# EasyEDA Pro project 作业4.eprj

# Schematic Schematic1
Board Name: Board1; Create Date: 2025-07-05; Page Name: P1; Project Name: 作业4; Schematic Name: Schematic1; Update Date: 2025-07-05; Company: 嘉立创EDA; Page Size: A4; Version: V1.0
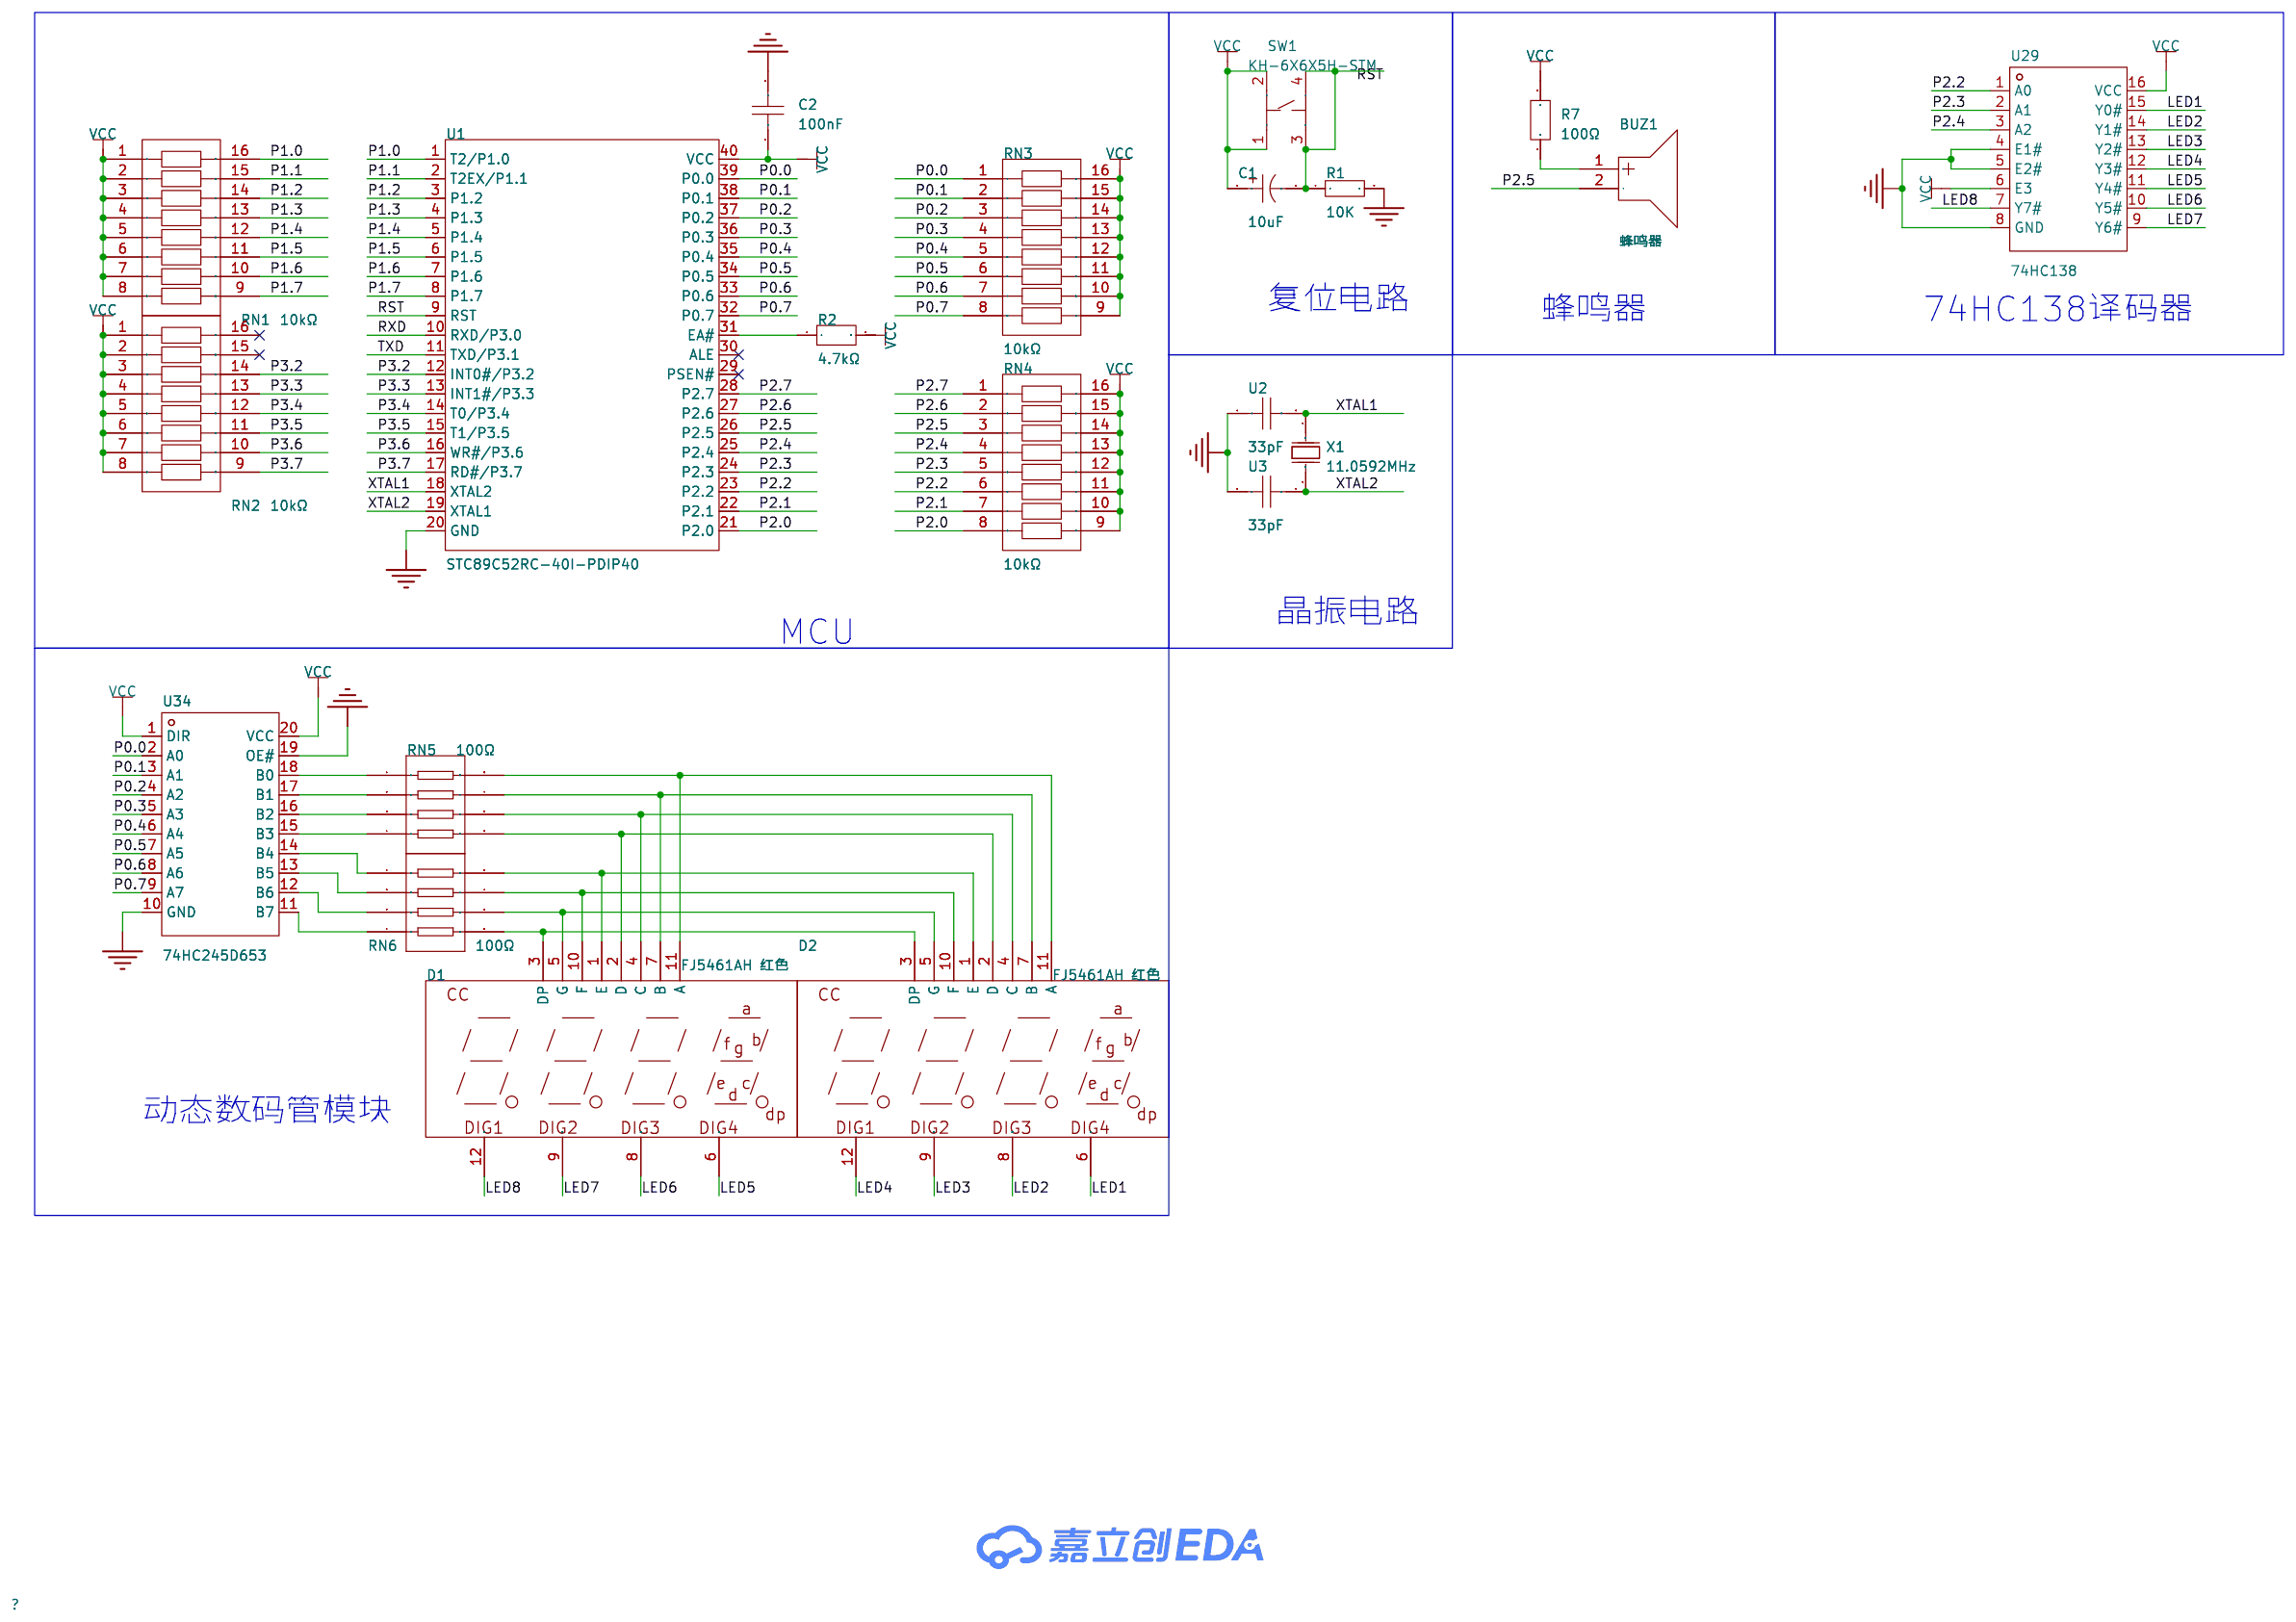
[diagram p0: schematic sheet]

## Parts
BUZ1  蜂鸣器  [BUZ-TH_BD9.0-P5.00-D0.6-FD]
C1  10uF  [CAP-TH_BD10.0-P5.00-D0.6-FD_1]
C2  100nF  [C0603]
D1  FJ5461AH 红色  [LED-SEG-TH_FJ5461AH]
D2  FJ5461AH 红色  [LED-SEG-TH_FJ5461AH]
R1  10K  [R0603]
R2  4.7kΩ  [R0805]
R7  100Ω  [R1206]
RN1  10kΩ  [DIP-16_L22.0-W6.7-P2.54-LS7.6-BL]
RN2  10kΩ  [DIP-16_L22.0-W6.7-P2.54-LS7.6-BL]
RN3  10kΩ  [DIP-16_L22.0-W6.7-P2.54-LS7.6-BL]
RN4  10kΩ  [DIP-16_L22.0-W6.7-P2.54-LS7.6-BL]
RN5  100Ω  [RES-ARRAY-SMD_0402-8P-L2.0-W1.0-BL]
RN6  100Ω  [RES-ARRAY-SMD_0402-8P-L2.0-W1.0-BL]
SW1  KH-6X6X5H-STM  [SW-SMD_4P-L6.0-W6.0-P4.50-LS9.0_H5.0]
U1  STC89C52RC-40I-PDIP40  [DIP-40_L52.0-W13.7-P2.54-LS15.2-BL]
U2  33pF  [C0603]
U3  33pF  [C0603]
U29  74HC138  [SOIC-16_L9.9-W3.9-P1.27-LS6.0-BL]
U34  74HC245D653  [SOIC-20_L13.0-W7.6-P1.27-LS10.3-BL]
X1  11.0592MHz  [HC-49US_L11.5-W4.5-P4.88]

## Library data of the parts
BUZ1 = 蜂鸣器: Supplier Part: C9900020875; Supplier Footprint: 插件; JLCPCB Part Class: 扩展库; Supplier: LCSC
C1 = CV100MPA16B: 容值:10uF;精度:±20%;额定电压:450V;纹波电流:200mA@100kHz;等效串联电阻(ESR):9Ω@100kHz;; LCSC Part Name: 10uF ±20% 450V; Supplier Part: C911241; Manufacturer: TWBOR(伯鸿); Supplier Footprint: 插件,D10xL16mm; JLCPCB Part Class: 扩展库; Datasheet: https://atta.szlcsc.com/upload/public/pdf/source/20201117/C911241_08C53D140102C9DE5D4425A5E1B3FE4F.pdf; Supplier: LCSC; Tolerance: ±20%; Voltage Rating: 450V; Ripple Current: 200mA@100kHz; Equivalent Series Resistance(ESR): 9Ω@100kHz; Pin Spacing: 5mm; Diameter: 10mm; Height - Seated (Max): 16mm; Lifetime: 5000hrs@105℃; Operating Temperature: -25℃~+105℃
C2 = 0603X7R104K250NT: 容值:100nF;精度:±10%;额定电压:25V;温度系数:X7R;; LCSC Part Name: 100nF ±10% 25V; Supplier Part: C48579280; Manufacturer: AIDE(爱迪电容); Supplier Footprint: 0603; JLCPCB Part Class: 扩展库; Datasheet: https://atta.szlcsc.com/upload/public/pdf/source/20210330/C2691711_5D01E1D4D7BF54205139C8425089DFE9.pdf; Supplier: LCSC; Tolerance: ±10%; Voltage Rating: 25V; Temperature Coefficient: X7R
D1 D2 = FJ5461AH 红色: 数码管位数:4位;功耗:-;发光颜色:红色;LED极性:共阴极;数字/字母大小(英寸):0.56;; LCSC Part Name: 4位0.56英寸红色数码管 共阴极; Supplier Part: C54396; Manufacturer: 志浩; Supplier Footprint: 插件; JLCPCB Part Class: 扩展库; Datasheet: https://atta.szlcsc.com/upload/public/pdf/source/20151111/1457707576636.pdf; Supplier: LCSC; Number of Characters: 4位; Display Type: 7段; Luminous Color: 红色; LED Polarity: 共阴极; Digit/Alpha Size(inch): 0.56
R1 = Res_0603: Supplier Footprint: 0603
R2 = ERJ-U06F4701V: 电阻类型:厚膜电阻;阻值:4.7kΩ;精度:±1%;功率:125mW;工作电压:-;温度系数:±100ppm/℃;; LCSC Part Name: 4.7kΩ ±1% 125mW 厚膜电阻; Supplier Part: C1859462; Manufacturer: PANASONIC(松下); Supplier Footprint: 0805; JLCPCB Part Class: 扩展库; Datasheet: https://atta.szlcsc.com/upload/public/pdf/source/20210624/C1859462_0DC8A541405FCF91B34CFE3F505433C6.pdf; Supplier: LCSC; Type: 厚膜电阻; Tolerance: ±1%; Power(Watts): 125mW; Temperature Coefficient: ±100ppm/℃; Operating Temperature: -55℃~+155℃
R7 = CQ06W4J0101T5E: 电阻类型:-;阻值:100Ω;精度:±5%;功率:250mW;工作电压:200V;; LCSC Part Name: 100Ω ±5% 250mW; Supplier Part: C2765667; Manufacturer: UNI-ROYAL(厚声); Supplier Footprint: 1206; JLCPCB Part Class: 扩展库; Datasheet: https://atta.szlcsc.com/upload/public/pdf/source/20210330/C2758625_90D19EEA9B8C23AA9BAF71D52BD1DB3E.pdf; Supplier: LCSC; Tolerance: ±5%; Power(Watts): 250mW; Voltage-Supply(Max): 200V; Operating Temperature: -55℃~+155℃
RN1-RN4 = 4116R-1-103LF: 电阻器数:8;阻值:10kΩ;精度:±2%;单个元件功率:250mW;温度系数:±100ppm/℃;; LCSC Part Name: 10kΩ ±2%; Supplier Part: C6087381; Manufacturer: BOURNS; Supplier Footprint: DIP-16; Datasheet: https://atta.szlcsc.com/upload/public/pdf/source/20210630/3D9C012B231BA1D1C9C6139B97130D1A.pdf; Supplier: LCSC; Number of Resistors: 8; Tolerance: ±2%; Power(Watts): 250mW; Temperature Coefficient: ±100ppm/℃; Number of Pins: 16
RN5 RN6 = 4D02WGJ0101TCE: 电阻器数:4;阻值:100Ω;精度:±5%;单个元件功率:62.5mW;温度系数:±200ppm/℃;; LCSC Part Name: 100Ω ±5%; Supplier Part: C48442; Manufacturer: UNI-ROYAL(厚声); Supplier Footprint: 0402x4; JLCPCB Part Class: 扩展库; Datasheet: https://atta.szlcsc.com/upload/public/pdf/source/20191224/C474318_2527498AE30E813171187CCD28401A71.pdf; Supplier: LCSC; Number of Resistors: 4; Tolerance: ±5%; Power(Watts): 62.5mW; Temperature Coefficient: ±200ppm/℃; Number of Pins: 8
SW1 = KH-6X6X5H-STM: 电路结构:单刀单掷;按钮形状:圆形按钮;安装方式:立贴;开关长度:6mm;开关宽度:6mm;开关高度:5mm;带支架:不带;触点电流:50mA;额定电压(DC):12V;机械寿命:8万次;; LCSC Part Name: 6*6*5mm 立贴 轻触开关; Supplier Part: C2837531; Manufacturer: kinghelm(金航标); Supplier Footprint: SMD; JLCPCB Part Class: 扩展库; Datasheet: https://atta.szlcsc.com/upload/public/pdf/source/20210608/C2837531_45E87AB996CE723B09405FF2EA209C4C.pdf; Supplier: LCSC; Circuit: 单刀单掷; Actuator Style: 圆形按钮; Mounting Style: 立贴; Switch Length: 6mm; Switch Width: 6mm; Switch Height: 5mm; Strike Gundam: 不带; Contact Current: 50mA; Voltage Rating (DC): 12V; Actuator/Cap Color: 黑色; Pin Style: 鸥翼型; Mechanical Life: 8万次
U1 = STC89C52RC-40I-PDIP40: CPU内核:51系列;应用领域:-;; Supplier Part: C14022; Manufacturer: STC; Supplier Footprint: DIP-40; JLCPCB Part Class: 扩展库; Datasheet: https://atta.szlcsc.com/upload/public/pdf/source/20250219/C2F0DDDE7C5E9ADA5B33742D18630F09.pdf; Supplier: LCSC; CPU Core: 51系列; Program Storage Size: 8KB; Program Memory Type: FLASH; Number of I/O: 35; Voltage - Supply: 3.3V~5.5V
U2 U3 = GRM1885C1H330FA01D: 容值:33pF;精度:±1%;额定电压:50V;温度系数:-;; LCSC Part Name: 33pF ±1% 50V; Supplier Part: C882522; Manufacturer: muRata(村田); Supplier Footprint: 0603; JLCPCB Part Class: 扩展库; Datasheet: https://atta.szlcsc.com/upload/public/pdf/source/20200305/C490387_23319AE8C154DEB24C505E6C82A8106A.pdf; Supplier: LCSC; Tolerance: ±1%; Voltage Rating: 50V
U29 = 74HC138: 三八译码器，74系列逻辑芯片,2.0V-6.0V供电电压。; LCSC Part Name: 停产; Supplier Part: C86611; Manufacturer: FM(富满); Supplier Footprint: SOIC-16; JLCPCB Part Class: 扩展库; Datasheet: https://atta.szlcsc.com/upload/public/pdf/source/20170103/1483435332227.pdf; Supplier: LCSC
U34 = 74HC245D653: Supplier Part: C70245; Supplier Footprint: SOIC-20-300mil; JLCPCB Part Class: 扩展库; Supplier: LCSC
X1 = X49SD110592MSD2SC: 晶振类型:直插晶振;频率:11.0592MHz;常温频差:±20ppm;负载电容:20pF;频率稳定度:±30ppm;; LCSC Part Name: HC-49US 11.0592MHZ 2P 49S 20PF ±20PPM -20~70℃（±30PPM）; Supplier Part: C2203; Manufacturer: YXC(扬兴晶振); Supplier Footprint: HC-49S; JLCPCB Part Class: 扩展库; Datasheet: https://atta.szlcsc.com/upload/public/pdf/source/20240329/977D7F2434F98B2BE33270BB9FF3D86D.pdf; Supplier: LCSC; Type: 直插晶振; Normal temperature Frequency Tolerance: ±20ppm; Load Capacitance: 20pF; Frequency Stability: ±30ppm; Operating Temperature: -20℃~+70℃

## Nets
GND: C2.2 R1.2 U1.20(GND) U2.1 U3.2 U29.4(E1#) U29.5(E2#) U29.8(GND) U34.10(GND) U34.19(OE#)
VCC: C1.1 C2.1 R2.2 R7.2 RN1.1 RN1.2 RN1.3 RN1.4 RN1.5 RN1.6 RN1.7 RN1.8 RN2.1 RN2.2 RN2.3 RN2.4 RN2.5 RN2.6 RN2.7 RN2.8 RN3.9 RN3.10 RN3.11 RN3.12 RN3.13 RN3.14 RN3.15 RN3.16 RN4.9 RN4.10 RN4.11 RN4.12 RN4.13 RN4.14 RN4.15 RN4.16 SW1.1 SW1.2 U1.40(VCC) U29.6(E3) U29.16(VCC) U34.1(DIR) U34.20(VCC)
LED1: D2.6(DIG4) U29.15(Y0#)
LED2: D2.8(DIG3) U29.14(Y1#)
LED3: D2.9(DIG2) U29.13(Y2#)
LED4: D2.12(DIG1) U29.12(Y3#)
LED5: D1.6(DIG4) U29.11(Y4#)
LED6: D1.8(DIG3) U29.10(Y5#)
LED7: D1.9(DIG2) U29.9(Y6#)
LED8: D1.12(DIG1) U29.7(Y7#)
P0.0: RN3.1 U1.39(P0.0) U34.2(A0)
P0.1: RN3.2 U1.38(P0.1) U34.3(A1)
P0.2: RN3.3 U1.37(P0.2) U34.4(A2)
P0.3: RN3.4 U1.36(P0.3) U34.5(A3)
P0.4: RN3.5 U1.35(P0.4) U34.6(A4)
P0.5: RN3.6 U1.34(P0.5) U34.7(A5)
P0.6: RN3.7 U1.33(P0.6) U34.8(A6)
P0.7: RN3.8 U1.32(P0.7) U34.9(A7)
P1.0: RN1.16 U1.1(T2/P1.0)
P1.1: RN1.15 U1.2(T2EX/P1.1)
P1.2: RN1.14 U1.3(P1.2)
P1.3: RN1.13 U1.4(P1.3)
P1.4: RN1.12 U1.5(P1.4)
P1.5: RN1.11 U1.6(P1.5)
P1.6: RN1.10 U1.7(P1.6)
P1.7: RN1.9 U1.8(P1.7)
P2.0: RN4.8 U1.21(P2.0)
P2.1: RN4.7 U1.22(P2.1)
P2.2: RN4.6 U1.23(P2.2) U29.1(A0)
P2.3: RN4.5 U1.24(P2.3) U29.2(A1)
P2.4: RN4.4 U1.25(P2.4) U29.3(A2)
P2.5: BUZ1.2(-) RN4.3 U1.26(P2.5)
P2.6: RN4.2 U1.27(P2.6)
P2.7: RN4.1 U1.28(P2.7)
P3.2: RN2.14 U1.12(INT0#/P3.2)
P3.3: RN2.13 U1.13(INT1#/P3.3)
P3.4: RN2.12 U1.14(T0/P3.4)
P3.5: RN2.11 U1.15(T1/P3.5)
P3.6: RN2.10 U1.16(WR#/P3.6)
P3.7: RN2.9 U1.17(RD#/P3.7)
RST: C1.2 R1.1 SW1.3 SW1.4 U1.9(RST)
RXD: U1.10(RXD/P3.0)
TXD: U1.11(TXD/P3.1)
XTAL1: U1.18(XTAL2) U2.2 X1.1(OSC1)
XTAL2: U1.19(XTAL1) U3.1 X1.2(OSC2)
$1N691: R2.1 U1.31(EA#)
$1N1178: BUZ1.1(+) R7.1
$1N1716: RN5.1 U34.18(B0)
$1N1717: RN5.2 U34.17(B1)
$1N1718: RN5.3 U34.16(B2)
$1N1719: RN5.4 U34.15(B3)
$1N1720: RN6.1 U34.14(B4)
$1N1721: RN6.2 U34.13(B5)
$1N1722: RN6.3 U34.12(B6)
$1N1723: RN6.4 U34.11(B7)
$1N1724: D1.11(A) D2.11(A) RN5.8
$1N1725: D1.7(B) D2.7(B) RN5.7
$1N1726: D1.4(C) D2.4(C) RN5.6
$1N1727: D1.2(D) D2.2(D) RN5.5
$1N1728: D1.1(E) D2.1(E) RN6.8
$1N1729: D1.10(F) D2.10(F) RN6.7
$1N1730: D1.5(G) D2.5(G) RN6.6
$1N1731: D1.3(DP) D2.3(DP) RN6.5

Not connected (* = marked no-connect by the designer): RN2 15* 16*; U1 29(PSEN#)* 30(ALE)*

## Notes on the sheet
- 复位电路
- 蜂鸣器
- 74HC138译码器
- 晶振电路
- MCU
- 动态数码管模块

# Board PCB1
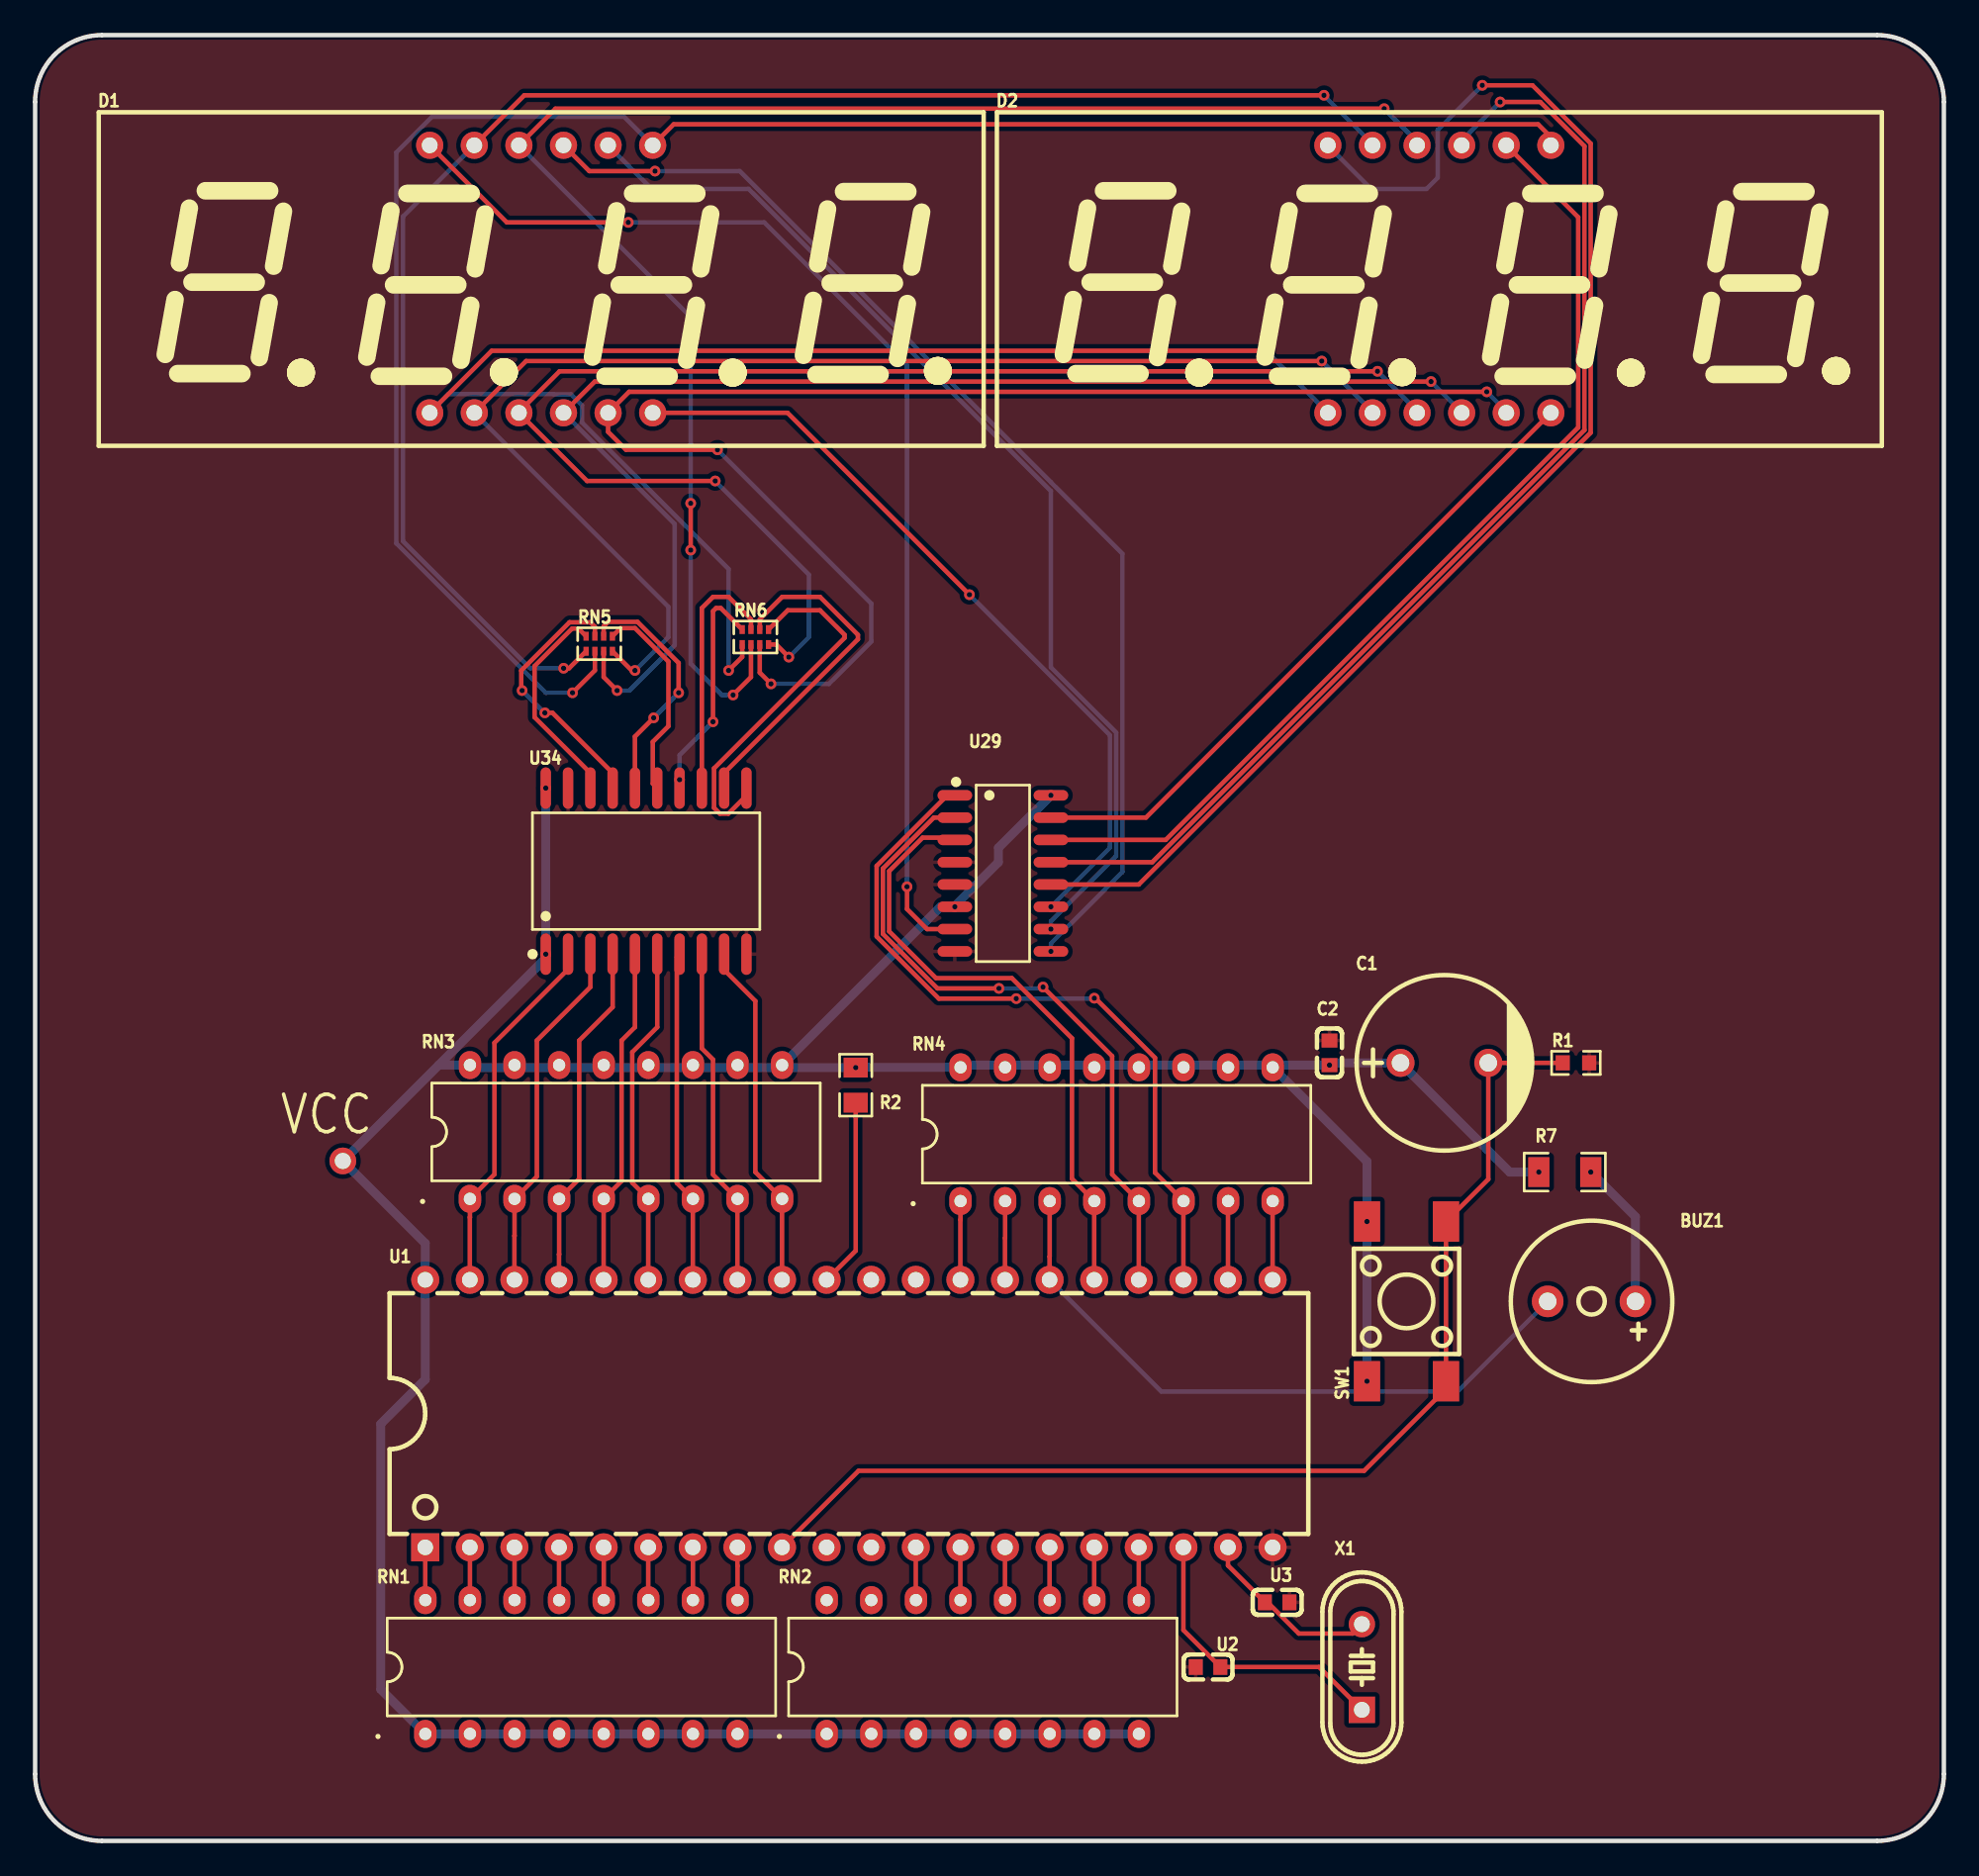
[diagram p1: board, top side]
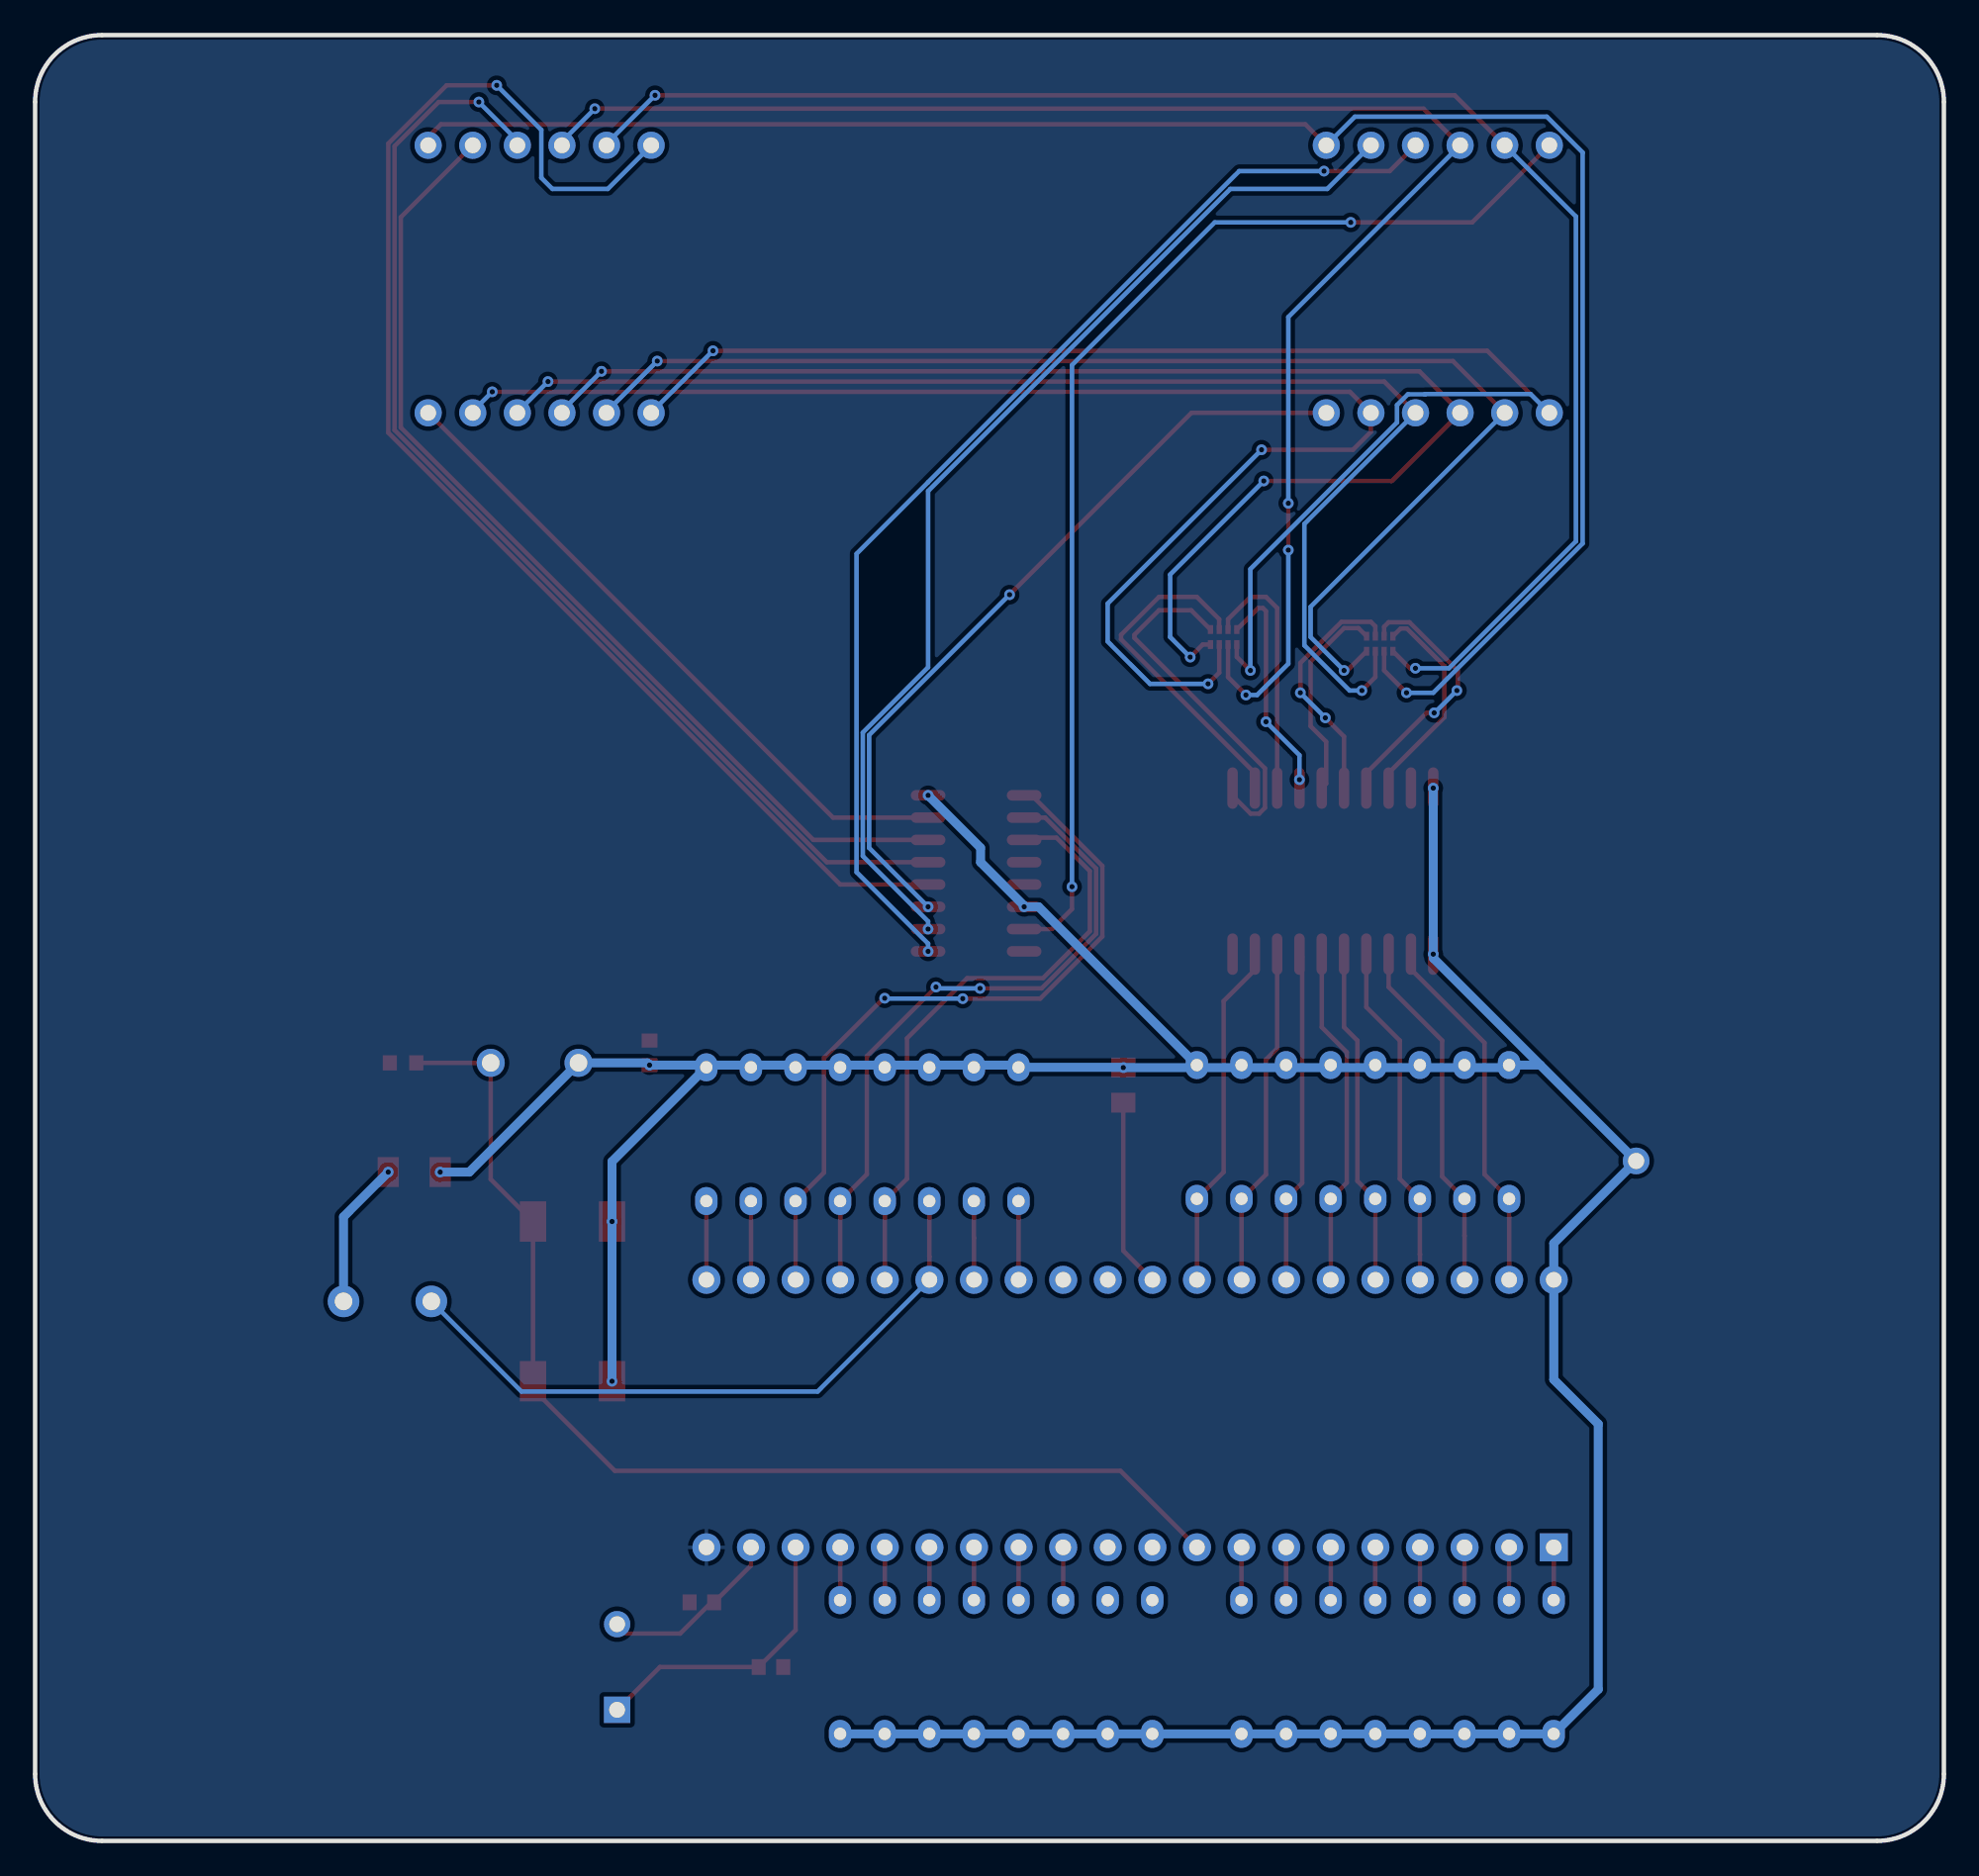
[diagram p2: board, bottom side, seen from below]

Outline 108.71 x 102.87 mm; copper layers: Top Layer, Bottom Layer. Coordinates in mm from the lower left corner of the outline.
Outline path: 0,99.06 0,3.81 arc(1.12,1.12) 3.81,0 104.9,0 arc(107.6,1.12) 108.71,3.81 108.71,99.06 arc(107.6,101.75) 104.9,102.87 3.81,102.87 arc(1.12,101.75) 0,99.06
Stack: Top Layer 0.035mm / Dielectric1 1.51mm FR4 er 4.5 / Bottom Layer 0.035mm

## Design rules (mm)
template: JLCPCB Capability(Two Layers Board)
spacing copperThickness1oz (default): track to track 0.102, other pairs 0.152 to 0.3
spacing copperThickness2oz: track to track 0.203, other pairs 0.152 to 0.3
track width copperThickness1oz (default): min 0.127, default 0.254, max 2.54
track width copperThickness2oz: min 0.203, default 0.254, max 2.54
differential pair differentialPair (default): width min 0.127, default 0.254, max 2.54; gap min 0.152, default 0.152
via viaSize (default): diameter min 0.5, default 0.61, max 10; hole min 0.3, default 0.305, max 6.3

## Placement (name value [footprint] x y rotation side)
BUZ1  蜂鸣器  [BUZ-TH_BD9.0-P5.00-D0.6-FD]  88.65 30.73 180 top
C1  10uF  [CAP-TH_BD10.0-P5.00-D0.6-FD_1]  80.26 44.32 0 top
C2  100nF  [C0603]  73.72 44.89 90 top
D1  FJ5461AH 红色  [LED-SEG-TH_FJ5461AH]  28.82 88.97 0 top
D2  FJ5461AH 红色  [LED-SEG-TH_FJ5461AH]  79.98 88.97 0 top
NOREF  -  [Pad_e21]  17.53 38.74 0 top
R1  10K  [R0603]  87.76 44.32 0 top
R2  4.7kΩ  [R0805]  46.74 43.05 90 top
R7  100Ω  [R1206]  87.12 38.1 180 top
RN1  10kΩ  [DIP-16_L22.0-W6.7-P2.54-LS7.6-BL]  31.11 9.91 0 top
RN2  10kΩ  [DIP-16_L22.0-W6.7-P2.54-LS7.6-BL]  53.98 9.91 0 top
RN3  10kΩ  [DIP-16_L22.0-W6.7-P2.54-LS7.6-BL]  33.66 40.39 0 top
RN4  10kΩ  [DIP-16_L22.0-W6.7-P2.54-LS7.6-BL]  61.6 40.26 0 top
RN5  100Ω  [RES-ARRAY-SMD_0402-8P-L2.0-W1.0-BL]  32.13 68.2 0 top
RN6  100Ω  [RES-ARRAY-SMD_0402-8P-L2.0-W1.0-BL]  41.02 68.58 0 top
SW1  KH-6X6X5H-STM  [SW-SMD_4P-L6.0-W6.0-P4.50-LS9.0_H5.0]  78.11 30.73 90 top
U1  STC89C52RC-40I-PDIP40  [DIP-40_L52.0-W13.7-P2.54-LS15.2-BL]  46.35 24.34 0 top
U2  33pF  [C0603]  66.8 9.91 0 top
U3  33pF  [C0603]  70.74 13.59 0 top
U29  74HC138  [SOIC-16_L9.9-W3.9-P1.27-LS6.0-BL]  55.12 55.12 270 top
U34  74HC245D653  [SOIC-20_L13.0-W7.6-P1.27-LS10.3-BL]  34.8 55.25 0 top
X1  11.0592MHz  [HC-49US_L11.5-W4.5-P4.88]  75.57 9.91 90 top

## Footprints (pads in the part's own frame, mm; a bottom-side part is the same pattern mirrored in y, then rotated)
BUZ-TH_BD9.0-P5.00-D0.6-FD
  round 1.8 hole 1: 1(-2.5,0) 2(2.5,0)
C0603
  rect 0.8x0.9 smd: 1(-0.7,0) 2(0.7,0)
CAP-TH_BD10.0-P5.00-D0.6-FD_1
  round 1.6 hole 1: 1(-2.5,0) 2(2.5,0)
DIP-16_L22.0-W6.7-P2.54-LS7.6-BL
  oval 1.276x1.595 hole 0.7: 1(-8.89,-3.81) 2(-6.35,-3.81) 3(-3.81,-3.81) 4(-1.27,-3.81) 5(1.27,-3.81) 6(3.81,-3.81) 7(6.35,-3.81) 8(8.89,-3.81) 9(8.89,3.81) 10(6.35,3.81) 11(3.81,3.81) 12(1.27,3.81) 13(-1.27,3.81) 14(-3.81,3.81) 15(-6.35,3.81) 16(-8.89,3.81)
DIP-40_L52.0-W13.7-P2.54-LS15.2-BL
  rect 1.6x1.6 hole 0.889: 1(-24.13,-7.62)
  round 1.6 hole 0.889: 2(-21.59,-7.62) 3(-19.05,-7.62) 4(-16.51,-7.62) 5(-13.97,-7.62) 6(-11.43,-7.62) 7(-8.89,-7.62) 8(-6.35,-7.62) 9(-3.81,-7.62) 10(-1.27,-7.62) 11(1.27,-7.62) 12(3.81,-7.62) 13(6.35,-7.62) 14(8.89,-7.62) 15(11.43,-7.62) 16(13.97,-7.62) 17(16.51,-7.62) 18(19.05,-7.62) 19(21.59,-7.62) 20(24.13,-7.62) 21(24.13,7.62) 22(21.59,7.62) 23(19.05,7.62) 24(16.51,7.62) 25(13.97,7.62) 26(11.43,7.62) 27(8.89,7.62) 28(6.35,7.62) 29(3.81,7.62) 30(1.27,7.62) 31(-1.27,7.62) 32(-3.81,7.62) 33(-6.35,7.62) 34(-8.89,7.62) 35(-11.43,7.62) 36(-13.97,7.62) 37(-16.51,7.62) 38(-19.05,7.62) 39(-21.59,7.62) 40(-24.13,7.62)
HC-49US_L11.5-W4.5-P4.88
  rect 1.5x1.5 hole 0.9: 1(-2.44,0)
  round 1.5 hole 0.9: 2(2.44,0)
LED-SEG-TH_FJ5461AH
  round 1.55 hole 0.9: 1(-6.35,-7.62) 2(-3.81,-7.62) 3(-1.27,-7.62) 4(1.27,-7.62) 5(3.81,-7.62) 6(6.35,-7.62) 7(6.35,7.62) 8(3.81,7.62) 9(1.27,7.62) 10(-1.27,7.62) 11(-3.81,7.62) 12(-6.35,7.62)
Pad_e21
  round 1.524 hole 0.914: 1(0,0)
R0603
  rect 0.806x0.864 smd: 1(-0.753,0) 2(0.753,0)
R0805
  rect 1.133x1.377 smd: 1(-1,0) 2(1,0)
R1206
  rect 1.208x1.701 smd: 1(-1.479,0) 2(1.479,0)
RES-ARRAY-SMD_0402-8P-L2.0-W1.0-BL
  rect 0.3x0.505 smd: 1(-0.75,0.427) 2(-0.25,0.427) 3(0.25,0.427) 4(0.75,0.427) 5(0.75,-0.427) 6(0.25,-0.427) 7(-0.25,-0.427) 8(-0.75,-0.427)
SOIC-16_L9.9-W3.9-P1.27-LS6.0-BL
  oval 0.602x1.971 smd: 1(-4.445,-2.736) 2(-3.175,-2.736) 3(-1.905,-2.736) 4(-0.635,-2.736) 5(0.635,-2.736) 6(1.905,-2.736) 7(3.175,-2.736) 8(4.445,-2.736) 9(4.445,2.736) 10(3.175,2.736) 11(1.905,2.736) 12(0.635,2.736) 13(-0.635,2.736) 14(-1.905,2.736) 15(-3.175,2.736) 16(-4.445,2.736)
SOIC-20_L13.0-W7.6-P1.27-LS10.3-BL
  oval 0.595x2.36 smd: 1(-5.715,-4.73) 2(-4.445,-4.73) 3(-3.175,-4.73) 4(-1.905,-4.73) 5(-0.635,-4.73) 6(0.635,-4.73) 7(1.905,-4.73) 8(3.175,-4.73) 9(4.445,-4.73) 10(5.715,-4.73) 11(5.715,4.73) 12(4.445,4.73) 13(3.175,4.73) 14(1.905,4.73) 15(0.635,4.73) 16(-0.635,4.73) 17(-1.905,4.73) 18(-3.175,4.73) 19(-4.445,4.73) 20(-5.715,4.73)
SW-SMD_4P-L6.0-W6.0-P4.50-LS9.0_H5.0
  rect 2.3x1.5 smd: 1(-4.55,2.25) 2(4.55,2.25) 3(-4.55,-2.25) 4(4.55,-2.25)

## Nets
As in the schematic, except:
VCC: C1.1 C2.1 NOREF.1 R2.2 R7.2 RN1.1 RN1.2 RN1.3 RN1.4 RN1.5 RN1.6 RN1.7 RN1.8 RN2.1 RN2.2 RN2.3 RN2.4 RN2.5 RN2.6 RN2.7 RN2.8 RN3.9 RN3.10 RN3.11 RN3.12 RN3.13 RN3.14 RN3.15 RN3.16 RN4.9 RN4.10 RN4.11 RN4.12 RN4.13 RN4.14 RN4.15 RN4.16 SW1.1 SW1.2 U1.40 U29.6 U29.16 U34.1 U34.20

Pads without a net: RN2 15 16; U1 29 30

## Via types
v1: diameter 0.61, hole 0.305, Top Layer to Bottom Layer, 48 vias

## Routing (per net, layer and track width the routed paths; a pad name or vN(x,y) marks a point on that pad's centre or on a via; arc(x,y) is an arc through that point)
VCC: length 211.1
  Bottom Layer w0.508: 22.99,44.2 NOREF.1 22.22,34.04 22.22,26.28 19.69,23.75 19.69,8.64 RN1.1 RN1.2 RN1.3 RN1.4 RN1.5 RN1.6 RN1.7 RN1.8 RN2.2 RN2.3 RN2.4 RN2.6 RN2.7 RN2.8 ; 22.99,44.2 24.77,44.2 24.91,44.05 v1(46.74,44.05) 46.75,44.07 52.7,44.07 52.83,44.19 v1(73.72,44.19) 73.85,44.32 C1.1 83.99,38.1 v1(85.64,38.1) ; 22.99,44.2 29.08,50.29 v1(29.08,50.52) v1(29.08,59.98) ; RN3.9 51.56,53.21 v1(52.38,53.21) 52.38,53.27 54.86,55.75 54.86,56.57 v1(57.85,59.56) ; RN4.9 75.86,38.7 v1(75.86,35.28) v1(75.86,26.18)
LED1: length 38
  Top Layer w0.254: U29.15 63.27,58.29 86.33,81.35
LED2: length 57.5
  Top Layer w0.254: D2.8 87.88,92.5 87.88,80.52 64.39,57.02 U29.14
LED3: length 66
  Top Layer w0.254: U29.13 63.62,55.75 88.24,80.37 88.24,96.55 85.73,99.06 v1(83.44,99.06)
  Bottom Layer w0.254: v1(83.44,99.06) 81.25,96.87 D2.9
LED4: length 79.3
  Top Layer w0.254: v1(82.42,100.01) 85.28,100.01 88.6,96.69 88.6,80.22 62.86,54.48 U29.12
  Bottom Layer w0.254: D2.12 73.63,96.58 76.1,94.11 79.25,94.11 79.88,94.74 79.88,97.47 v1(82.42,100.01)
LED5: length 44.8
  Top Layer w0.254: 35.17,81.35 42.85,81.35 v1(53.21,70.99)
  Bottom Layer w0.254: v1(53.21,70.99) 61.21,62.99 61.21,56.57 v1(57.85,53.21)
LED6: length 61.4
  Bottom Layer w0.254: v1(57.85,51.94) 57.85,52.39 61.57,56.1 61.57,63.14 57.85,66.86 57.85,76.89 40.64,94.11 35.12,94.11 32.63,96.59
LED7: length 65.8
  Top Layer w0.254: v1(35.31,95.12) 31.56,95.12 D1.9
  Bottom Layer w0.254: v1(35.31,95.12) 40.13,95.12 57.85,77.4 57.85,77.4 61.93,73.32 61.93,55.19 57.85,51.12 v1(57.85,50.67)
LED8: length 66.6
  Top Layer w0.254: U29.7 50.8,51.94 49.66,53.09 v1(49.66,54.36) ; 22.47,96.59 26.86,92.2 v1(33.78,92.2)
  Bottom Layer w0.254: v1(49.66,54.36) 49.66,84.07 41.53,92.2 v1(33.78,92.2)
P0.0: length 20.9
  Top Layer w0.254: U34.2 30.35,49.66 26.16,45.47 26.16,37.97 24.77,36.58 24.77,35.52 24.76,35.52 24.76,31.96
P0.1: length 20.3
  Top Layer w0.254: 27.3,31.96 27.3,34.47 27.31,34.47 27.31,36.58 28.58,37.85 28.58,45.59 31.62,48.64 31.62,50.52
P0.2: length 19.8
  Top Layer w0.254: 29.84,31.96 29.84,33.41 29.84,33.42 29.84,36.58 30.99,37.72 30.99,45.59 32.89,47.5 U34.4
P0.3: length 19.3
  Top Layer w0.254: U34.5 34.16,46.36 33.4,45.59 33.4,37.59 32.38,36.57 32.38,31.96
P0.4: length 19.5
  Top Layer w0.254: U34.6 35.43,46.36 34.01,44.93 34.01,37.49 34.92,36.58 34.92,36.57 34.92,31.96
P0.5: length 19
  Top Layer w0.254: 37.46,36.57 37.46,36.58 ; 37.46,36.57 36.55,37.48 36.55,50.36 U34.7 ; 37.46,36.57 37.46,31.96
P0.6: length 19.4
  Top Layer w0.254: 40,36.57 38.61,37.96 38.61,44.51 37.97,45.14 U34.8 ; 40,36.57 40,31.96 ; 40,36.57 RN3.7
P0.7: length 19.9
  Top Layer w0.254: 39.24,50.52 39.24,49.62 41.02,47.84 41.02,38.1 RN3.8 42.54,36.57 42.54,31.96
P1.0: length 3
  Top Layer w0.254: U1.1 22.22,13.72 RN1.16
P1.1: length 3
  Top Layer w0.254: U1.2 24.77,16.72 RN1.15
P1.2: length 3
  Top Layer w0.254: U1.3 27.31,16.72 RN1.14
P1.3: length 3
  Top Layer w0.254: RN1.13 29.84,13.72 U1.4
P1.4: length 3
  Top Layer w0.254: U1.5 32.39,16.72 RN1.12
P1.5: length 3
  Top Layer w0.254: U1.6 34.92,13.72 RN1.11
P1.6: length 3
  Top Layer w0.254: RN1.10 37.46,16.72 U1.7
P1.7: length 3
  Top Layer w0.254: U1.8 40,15.67 40.01,15.66 RN1.9
P2.0: length 4.5
  Top Layer w0.254: 70.48,31.96 70.48,36.44 RN4.8
P2.1: length 4.5
  Top Layer w0.254: 67.94,31.96 67.94,36.44 RN4.7
P2.2: length 42.2
  Top Layer w0.254: v1(55.88,47.98) 51.47,47.98 47.93,51.52 47.93,55.54 51.95,59.56 U29.1 ; 65.4,31.96 65.4,36.44 RN4.6 63.78,38.07 63.78,44.61 60.38,48.01 v1(60.33,48.01)
  Bottom Layer w0.254: v1(55.88,47.98) 60.3,47.98 v1(60.33,48.01)
P2.3: length 38.4
  Top Layer w0.254: v1(57.4,48.64) 61.34,44.7 61.34,37.97 62.86,36.45 62.86,36.44 62.86,31.96 ; v1(54.9,48.57) 51.39,48.57 48.29,51.67 48.29,55.39 51.19,58.29 U29.2
  Bottom Layer w0.254: v1(54.9,48.57) 57.33,48.57 v1(57.4,48.64)
P2.4: length 35.2
  Top Layer w0.254: U29.3 52.26,57.15 50.55,57.15 48.64,55.25 48.64,51.82 51.31,49.15 55.63,49.15 59.05,45.72 59.05,37.72 RN4.4 60.32,36.44 60.32,31.96
P2.5: length 37.6
  Top Layer w0.254: 57.78,31.96 57.78,33.29 57.79,33.29 RN4.3
  Bottom Layer w0.254: 57.78,31.96 64.14,25.6 81.01,25.6 BUZ1.2
P2.6: length 4.5
  Top Layer w0.254: 55.24,36.45 55.24,34.35 55.24,34.34 55.24,31.96
P2.7: length 4.5
  Top Layer w0.254: 52.7,31.96 52.7,35.39 52.7,35.4 52.7,36.45
P3.2: length 2.9
  Top Layer w0.254: U1.12 50.16,13.84
P3.3: length 2.9
  Top Layer w0.254: U1.13 52.7,13.84
P3.4: length 2.9
  Top Layer w0.254: U1.14 55.24,13.84
P3.5: length 2.9
  Top Layer w0.254: U1.15 57.78,13.84
P3.6: length 2.9
  Top Layer w0.254: U1.16 60.32,13.84
P3.7: length 2.9
  Top Layer w0.254: U1.17 62.86,13.84
RST: length 65.4
  Top Layer w0.254: U1.9 46.9,21.08 75.69,21.08 80.36,25.75 SW1.3 SW1.4 82.76,37.69 C1.2 R1.1
XTAL1: length 16.8
  Top Layer w0.254: U1.18 65.4,12.01 U2.2 73.13,9.91 X1.1
XTAL2: length 10.5
  Top Layer w0.254: X1.2 75.03,11.81 71.97,11.81 70.19,13.59 U3.1 67.94,15.69 U1.19
$1N691: length 10.8
  Top Layer w0.254: R2.1 46.74,33.62 45.08,31.96
$1N1178: length 8.4
  Bottom Layer w0.508: BUZ1.1 91.15,35.56 v1(88.6,38.1)
$1N1716: length 12.3
  Top Layer w0.254: RN5.1 30.94,69.06 30.58,69.06 28.45,66.93 28.45,64.01 31.62,60.83 31.62,59.98
$1N1717: length 15.1
  Top Layer w0.254: RN5.2 31.88,69.17 31.63,69.42 30.44,69.42 27.69,66.67 27.69,65.58 v1(27.74,65.53) ; v1(29.03,64.26) 29.46,64.26 32.89,60.83 U34.17
  Bottom Layer w0.254: v1(27.74,65.53) 29.01,64.26 v1(29.03,64.26)
$1N1718: length 14.1
  Top Layer w0.254: RN5.3 32.38,69.19 32.64,69.44 34.31,69.44 36.65,67.1 v1(36.65,65.41) ; v1(35.23,63.98) 34.16,62.91 U34.16
  Bottom Layer w0.254: v1(35.23,63.98) 35.23,63.98 v1(36.65,65.41)
$1N1719: length 11.8
  Top Layer w0.254: RN5.4 33.34,69.09 34.16,69.09 36.07,67.18 36.07,63.5 35.18,62.61 35.18,60.23 U34.15
$1N1720: length 12.6
  Top Layer w0.254: RN6.1 39.05,70.23 38.79,70.23 38.61,70.05 v1(38.61,63.75)
  Bottom Layer w0.254: v1(38.61,63.75) 36.7,61.85 v1(36.7,60.45)
$1N1721: length 14.4
  Top Layer w0.254: RN6.2 40.77,69.59 39.5,70.87 38.61,70.87 37.97,70.23 U34.13
$1N1722: length 19.5
  Top Layer w0.254: RN6.3 41.27,69.01 41.27,69.6 42.55,70.87 44.7,70.87 46.86,68.71 46.86,68.45 39.24,60.83 39.24,59.98
$1N1723: length 21.1
  Top Layer w0.254: U34.11 40.51,59.55 39.48,58.52 39,58.52 38.67,58.85 38.67,61.1 46.1,68.53 46.1,68.71 44.7,70.1 42.87,70.1 RN6.4
$1N1724: length 91.6
  Top Layer w0.254: v1(73.41,99.44) 27.86,99.44 D1.11 ; RN5.8 30.41,66.8 v1(30.1,66.8)
  Bottom Layer w0.254: v1(73.41,99.44) 76.17,96.68 D2.11 ; D1.11 20.95,92.54 20.95,74.04 28.19,66.8 v1(30.1,66.8)
$1N1725: length 107.3
  Top Layer w0.254: 35.17,96.59 36.37,97.79 85.6,97.79 86.33,97.06 86.33,96.59 ; RN5.7 31.88,66.68 v1(30.61,65.41)
  Bottom Layer w0.254: 35.17,96.59 33.54,98.22 22.61,98.22 20.57,96.19 20.57,73.91 29.08,65.41 v1(30.61,65.41)
$1N1726: length 75.4
  Top Layer w0.254: v1(79.5,83.13) 31.87,83.13 D1.4 ; RN5.6 32.38,66.3 v1(33.15,65.53)
  Bottom Layer w0.254: v1(79.5,83.13) 81.25,81.39 D2.4 ; v1(33.15,65.53) 33.85,65.53 36.42,68.11 36.42,75.02 D1.4
$1N1727: length 75.4
  Top Layer w0.254: v1(73.28,84.3) 27.96,84.3 D1.2 ; RN5.5 33.98,66.68 v1(34.16,66.68)
  Bottom Layer w0.254: D2.2 76.17,81.41 v1(73.28,84.3) ; D1.2 36.07,70.3 36.07,68.58 v1(34.16,66.68)
$1N1728: length 83.7
  Top Layer w0.254: RN6.8 40.27,67.45 39.62,66.8 ; 22.47,81.35 26.01,84.89 v1(70.1,84.89)
  Bottom Layer w0.254: 22.47,81.35 23.54,82.42 29.53,82.42 29.54,82.41 30.53,82.41 31.15,81.79 31.15,80.8 39.5,72.45 v1(39.5,66.68) ; v1(70.1,84.89) 73.63,81.36 D2.1
$1N1729: length 93
  Top Layer w0.254: v1(39.75,65.28) 40.77,66.3 RN6.7 ; v1(37.34,73.53) v1(37.34,76.2) ; 27.55,96.59 29.64,98.68 v1(76.83,98.68)
  Bottom Layer w0.254: v1(37.34,73.53) 37.34,67.06 39.12,65.28 v1(39.75,65.28) ; v1(76.83,98.68) 78.71,96.81 78.71,96.59 ; 27.55,96.59 37.34,86.81 v1(37.34,76.2)
$1N1730: length 83.7
  Top Layer w0.254: v1(41.91,65.91) 41.27,66.55 RN6.6 ; v1(82.68,82.55) 33.83,82.55 32.63,81.35 32.63,80.27 33.66,79.25 v1(38.86,79.25)
  Bottom Layer w0.254: D2.5 83.79,81.44 v1(82.68,82.55) ; v1(41.91,65.91) 45.21,65.91 47.63,68.33 47.63,70.49 v1(38.86,79.25)
$1N1731: length 80.2
  Top Layer w0.254: v1(42.93,67.44) 42.21,68.15 RN6.5 ; v1(38.73,77.47) 31.44,77.47 27.55,81.35 27.55,81.4 29.87,83.72 v1(76.45,83.72)
  Bottom Layer w0.254: 78.71,81.35 78.71,81.47 v1(76.45,83.72) ; v1(38.73,77.47) 44.07,72.14 44.07,68.58 v1(42.93,67.44)

## Copper pours and planes (outline as drawn; the poured copper is in the pictures)
GND on Top Layer: -0.13,103 108.84,103 108.84,0 -0.13,0
GND on Bottom Layer: -0.13,103 108.84,103 108.84,-0.25 -0.13,-0.25

## Text on the board
Top Silkscreen Layer: VCC
